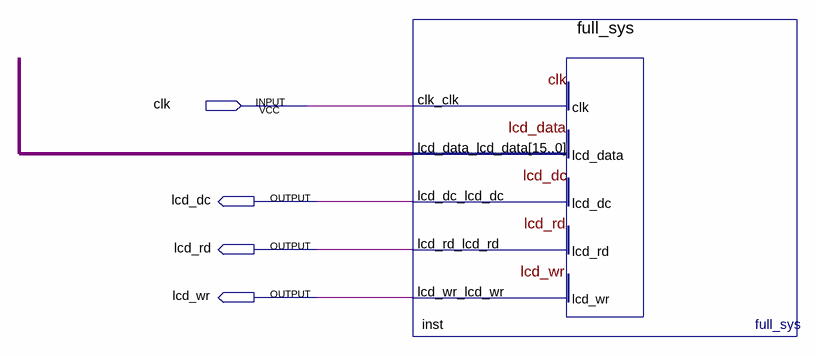
[diagram p0: schematic sheet]
// Quartus schematic lcd_sys.bdf as structural Verilog: 1 symbols, 4 pins
module lcd_sys (
  input  clk,
  output lcd_dc,
  output lcd_rd,
  output lcd_wr
);

  wire [15:0] inst_lcd_data_lcd_data;

  full_sys inst (
    .clk_clk(clk), .lcd_data_lcd_data(inst_lcd_data_lcd_data), .lcd_dc_lcd_dc(lcd_dc),
    .lcd_rd_lcd_rd(lcd_rd), .lcd_wr_lcd_wr(lcd_wr));
endmodule
